# Altium schematic sheet Encoder.SchDoc
size A; SheetNumber: 1; SheetTotal: 1
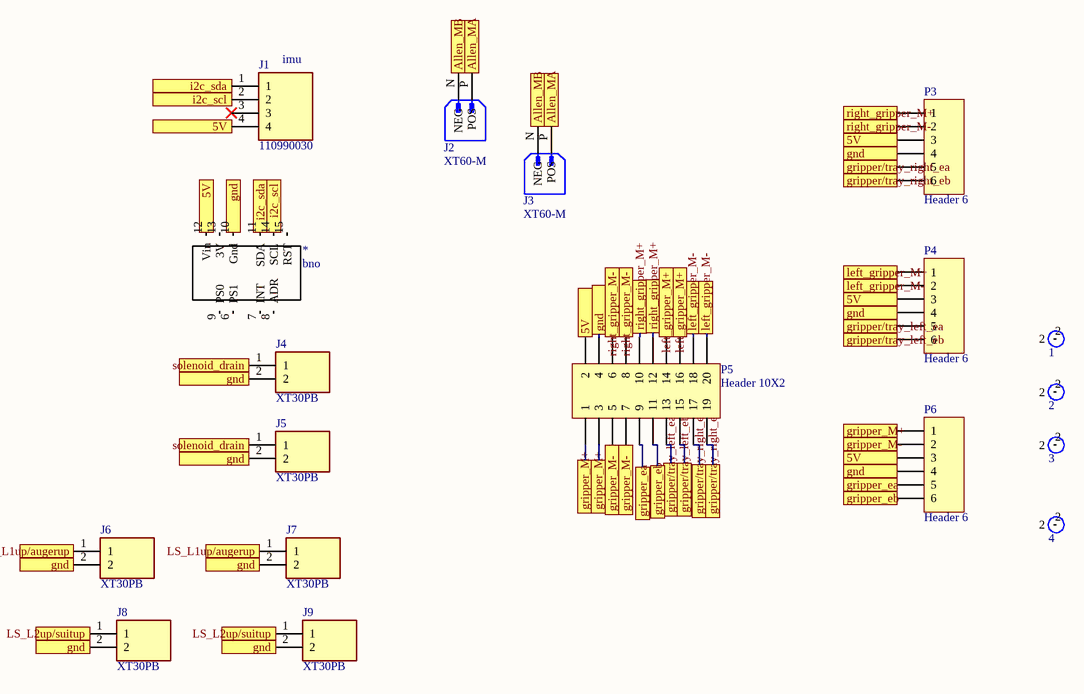
[diagram p0: Encoder.SchDoc]

## Parts
1  mountinghole_np  [np_mountinghole]  (value not drawn)
2  mountinghole_np  [np_mountinghole]  (value not drawn)
3  mountinghole_np  [np_mountinghole]  (value not drawn)
4  mountinghole_np  [np_mountinghole]  (value not drawn)
*  bno  [BNO]
J1  110990030  [SEEED_110990030]
J2  XT60-M  [AMASS_XT60-M]
J3  XT60-M  [AMASS_XT60-M]
J4  XT30PB  [XT30PB]
J5  XT30PB  [XT30PB]
J6  XT30PB  [XT30PB]
J7  XT30PB  [XT30PB]
J8  XT30PB  [XT30PB]
J9  XT30PB  [XT30PB]
P3  Header 6  [HDR1X6]
P4  Header 6  [HDR1X6]
P5  Header 10X2  [HDR2X10]
P6  Header 6  [HDR1X6]

## Ports
5V, Allen_MA, Allen_MB, gnd, gripper/tray_left_ea, gripper/tray_left_eb, gripper/tray_right_ea, gripper/tray_right_eb, gripper_ea, gripper_eb, gripper_M+, gripper_M-, i2c_scl, i2c_sda, left_gripper_M+, left_gripper_M-, LS_L1up/augerup, LS_L2up/suitup, right_gripper_M+, right_gripper_M-, solenoid_drain

## Nets
5V: *.12(Vin) J1.4 P3.3 P4.3 P5.2 P6.3 ; port 5V
Allen_MA: J2.P(POS) J3.P(POS) ; port Allen_MA
Allen_MB: J2.N(NEG) J3.N(NEG) ; port Allen_MB
gnd: *.10(Gnd) J4.2 J5.2 J6.2 J7.2 J8.2 J9.2 P3.4 P4.4 P5.4 P6.4 ; port gnd
gripper/tray_left_ea: P4.5 P5.13 ; port gripper/tray_left_ea
gripper/tray_left_eb: P4.6 P5.15 ; port gripper/tray_left_eb
gripper/tray_right_ea: P3.5 P5.19 ; port gripper/tray_right_ea
gripper/tray_right_eb: P3.6 P5.17 ; port gripper/tray_right_eb
gripper_ea: P5.9 P6.5 ; port gripper_ea
gripper_eb: P5.11 P6.6 ; port gripper_eb
gripper_M+: P5.1 P5.3 P6.1 ; port gripper_M+
gripper_M-: P5.5 P5.7 P6.2 ; port gripper_M-
i2c_scl: *.14(SCL) J1.2 ; port i2c_scl
i2c_sda: *.11(SDA) J1.1 ; port i2c_sda
left_gripper_M+: P4.1 P5.14 P5.16 ; port left_gripper_M+
left_gripper_M-: P4.2 P5.18 P5.20 ; port left_gripper_M-
LS_L1up/augerup: J6.1 J7.1 ; port LS_L1up/augerup
LS_L2up/suitup: J8.1 J9.1 ; port LS_L2up/suitup
right_gripper_M+: P3.1 P5.10 P5.12 ; port right_gripper_M+
right_gripper_M-: P3.2 P5.6 P5.8 ; port right_gripper_M-
solenoid_drain: J4.1 J5.1 ; port solenoid_drain

Not connected (* = marked no-connect by the designer): 1 2; 2 2; 3 2; 4 2; * 6(PS1) 7(INT) 8(ADR) 9(PS0) 13(3V) 15(RST); J1 3*

## Notes on the sheet
- (near J1) imu

## Library data of the parts
J1 = 110990030: GROVE 2MM 4PIN VERT CONN 10PCS; MF: Seeed Technology; Arrow_Electronics-Purchase-URL: https://snapeda.com/shop?store=Arrow+Electronics&id=583576; Availability: Good; Package: None; Price: None; Mouser-Purchase-URL: https://snapeda.com/shop?store=Mouser&id=583576; MP: 110990030; SnapEDA_Link: https://www.snapeda.com/parts/110990030/Seeed%20Technology%20Co.,%20Ltd/view-part/583576/?ref=snap; Value: *
J2 J3 = XT60-M: Plug; DC supply; XT60; male; PIN: 2; for cable; soldered; 30A; 500V; MF: AMASS; Package: Package; Availability: Not in stock; SnapEDA_Link: https://www.snapeda.com/parts/XT60-M/AMASS/view-part/?ref=snap; Check_prices: https://www.snapeda.com/parts/XT60-M/AMASS/view-part/?ref=eda; MP: XT60-M; Price: None; Value: *
J4-J9 = XT30PB: Connector; Manufacturer_Name: Amass; Datasheet Link: https://www.tme.eu/Document/4acc913878197f8c2e30d4b8cdc47230/XT30UPB%20SPEC.pdf; Height: 10.7mm; Manufacturer_Part_Number: XT30PB
P3 P4 P6 = Header 6: Header, 6-Pin; LatestRevisionDate: 17-Jul-2002; LatestRevisionNote: Re-released for DXP Platform.; Publisher: Altium Limited
P5 = Header 10X2: Header, 10-Pin, Dual row; LatestRevisionDate: 17-Jul-2002; LatestRevisionNote: Re-released for DXP Platform.; Publisher: Altium Limited